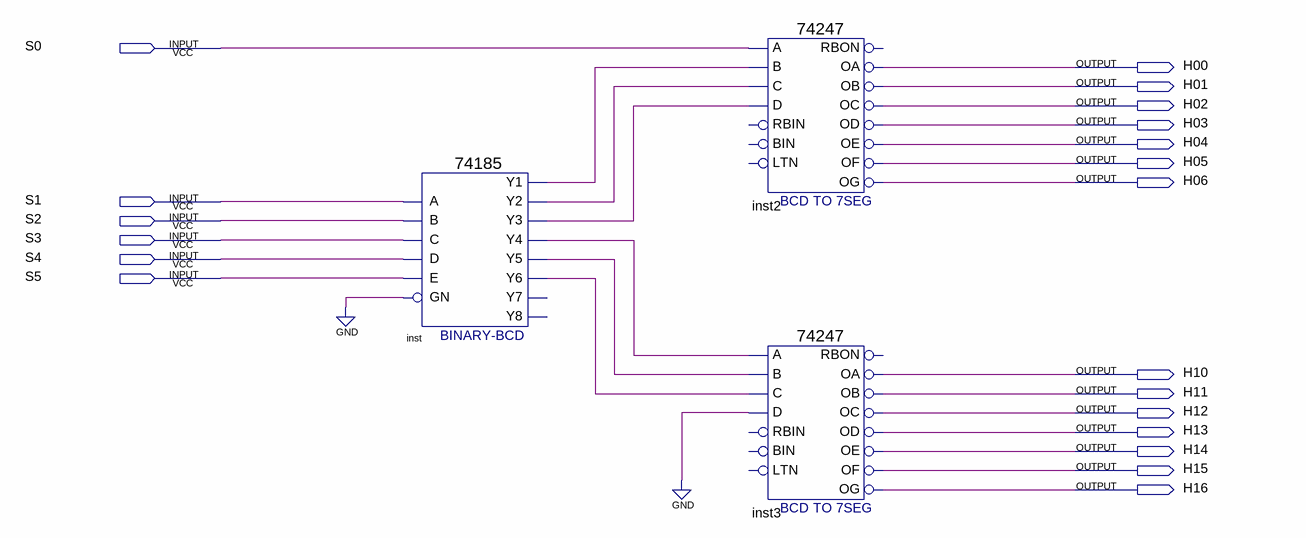
[diagram p0: schematic sheet]
// Quartus schematic 3_esc_BCD.bdf as structural Verilog: 3 symbols, 20 pins
module \3_esc_BCD  (
  input  S0,
  input  S1,
  input  S2,
  input  S3,
  input  S4,
  input  S5,
  output H00,
  output H01,
  output H02,
  output H03,
  output H04,
  output H05,
  output H06,
  output H10,
  output H11,
  output H12,
  output H13,
  output H14,
  output H15,
  output H16
);

  wire inst_y1, inst_y2, inst_y3, inst_y4, inst_y5, inst_y6;

  \74185  inst (
    .A(S1), .B(S2), .D(S4), .C(S3), .E(S5), .GN(1'b0), .Y1(inst_y1), .Y3(inst_y3), .Y2(inst_y2),
    .Y5(inst_y5), .Y4(inst_y4), .Y6(inst_y6));  // open: Y8, Y7
  \74247  inst2 (
    .A(S0), .B(inst_y1), .C(inst_y2), .D(inst_y3), .OF(H05), .OC(H02), .OD(H03), .OE(H04), .OA(H00),
    .OB(H01), .OG(H06));  // open: LTN, BIN, RBIN, RBON
  \74247  inst3 (
    .A(inst_y4), .B(inst_y5), .C(inst_y6), .D(1'b0), .OF(H15), .OC(H12), .OD(H13), .OE(H14), .OA(H10),
    .OB(H11), .OG(H16));  // open: LTN, BIN, RBIN, RBON
endmodule
